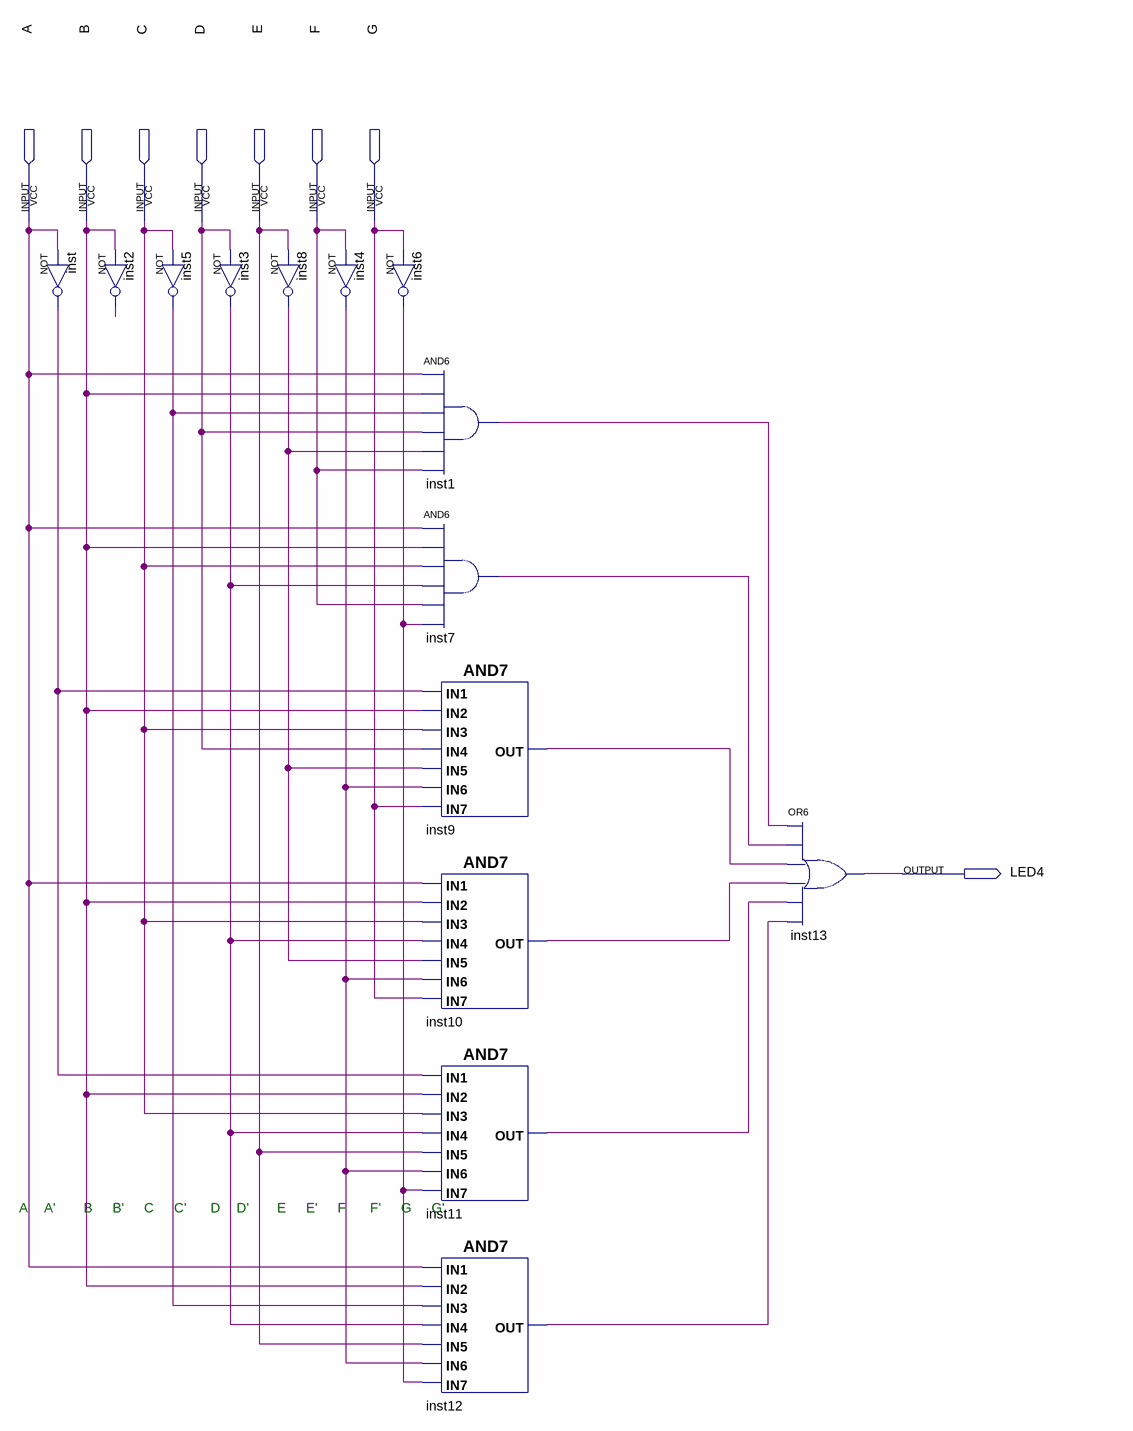
[diagram p0: schematic sheet]
// Quartus schematic LED4LINHA6MATRIZ.bdf as structural Verilog: 14 symbols, 8 pins
module LED4LINHA6MATRIZ (
  input  A,
  input  B,
  input  C,
  input  D,
  input  E,
  input  F,
  input  G,
  output LED4
);

  wire inst1_out, inst2_out, inst3_out, inst4_out, inst5_out, inst6_out, inst7_out, inst8_out, inst9_out,
       inst10_out, inst11_out, inst12_out, inst_out;

  not inst (inst_out, A);
  not inst2 (inst2_out, B);
  not inst5 (inst5_out, C);
  not inst3 (inst3_out, D);
  not inst8 (inst8_out, E);
  not inst4 (inst4_out, F);
  not inst6 (inst6_out, G);
  and inst1 (inst1_out, A, B, inst5_out, D, inst8_out, F);
  and inst7 (inst7_out, A, B, C, inst3_out, F, inst6_out);
  and inst9 (inst9_out, inst_out, B, C, D, inst8_out, inst4_out, G);
  and inst10 (inst10_out, A, B, C, inst3_out, inst8_out, inst4_out, G);
  and inst11 (inst11_out, inst_out, B, C, inst3_out, E, inst4_out, inst6_out);
  and inst12 (inst12_out, A, B, inst5_out, inst3_out, E, inst4_out, inst6_out);
  or inst13 (LED4, inst1_out, inst7_out, inst9_out, inst10_out, inst11_out, inst12_out);

  // Notes on the sheet:
  //   A    A'       B     B'     C     C'      D    D'       E     E'     F      F'     G     G'
endmodule
